# EAGLE design untitled (EAGLE 8.2.0)
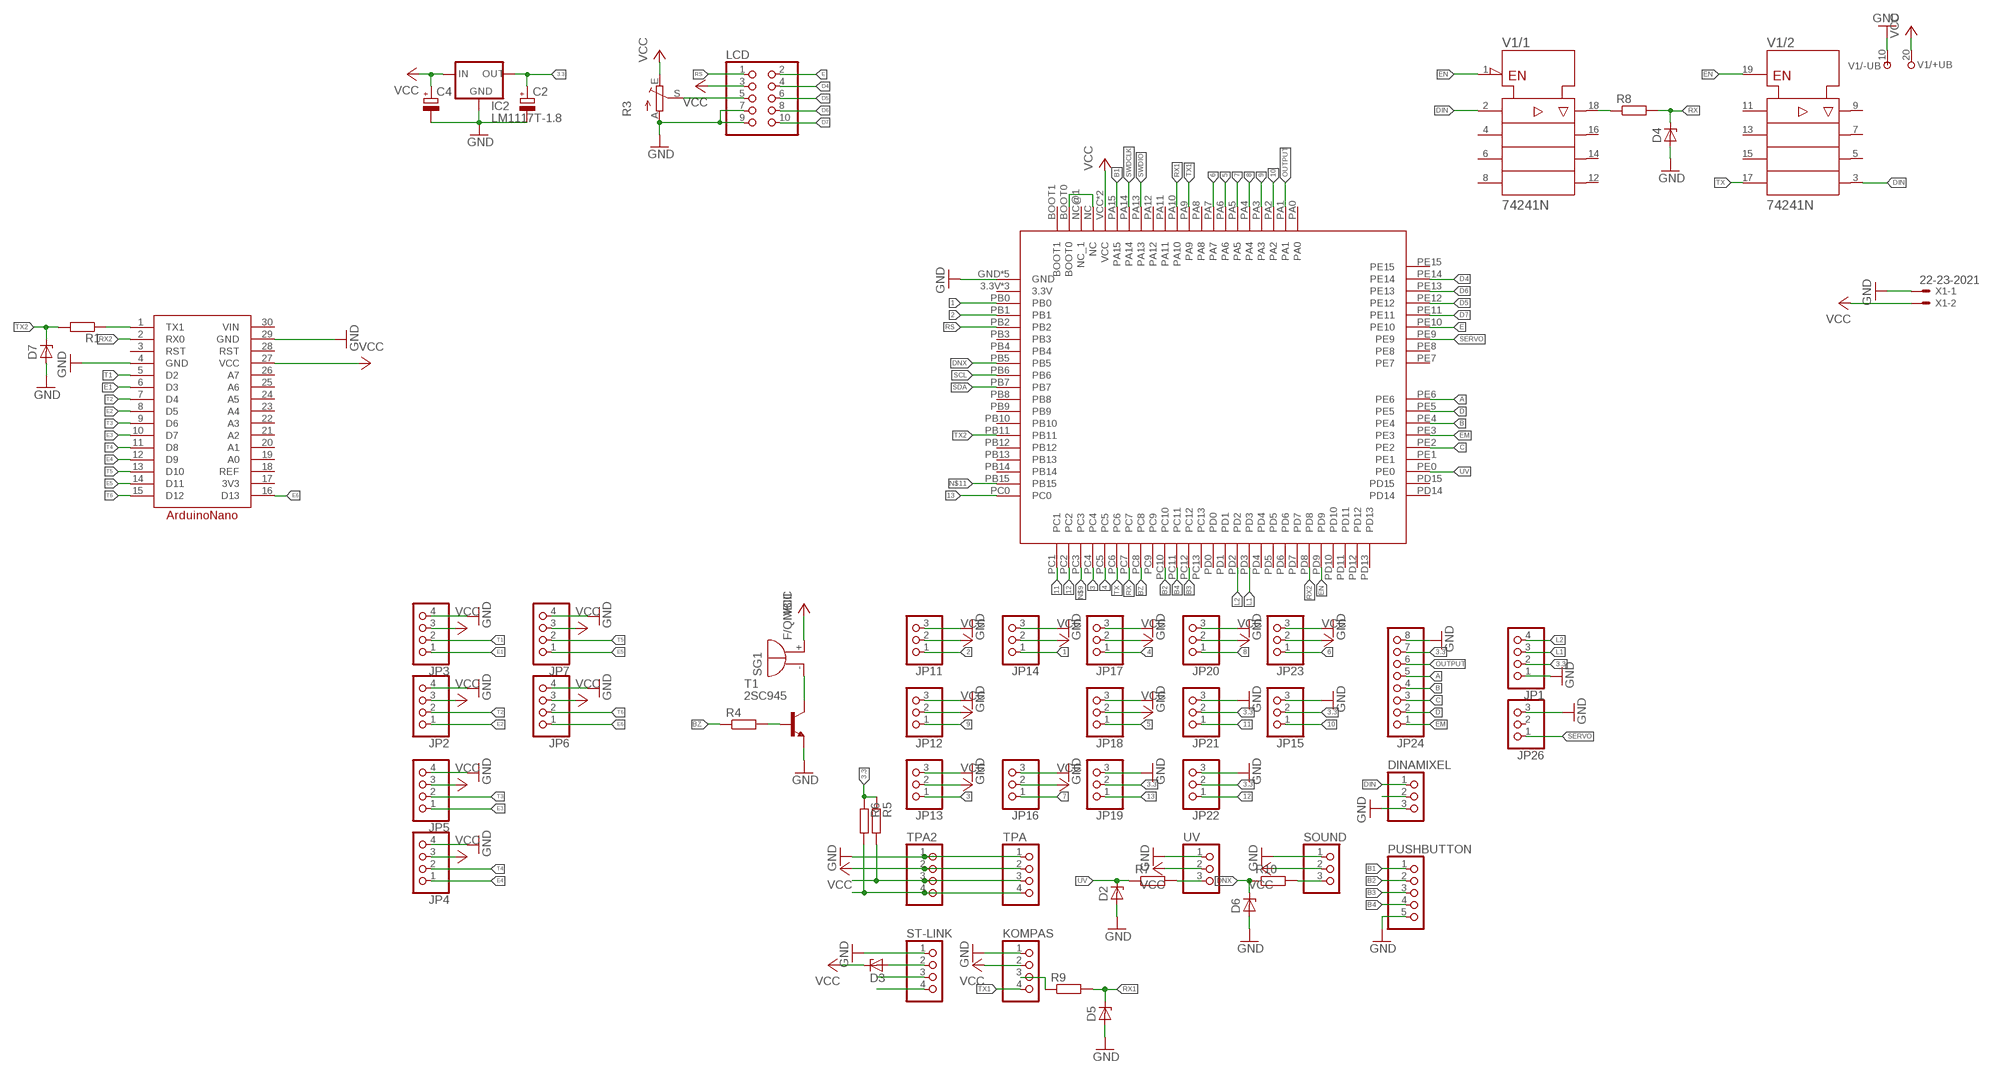
[diagram p0: schematic, sheet 1]

## Parts
A1  ARDUINONANO  [ARDUINONANO]
C2  CPOL-EUE2.5-5  [E2,5-5]
C4  CPOL-EUE2.5-5  [E2,5-5]
D2  ZENER-DIODEDO34-7  [DO34Z7]
D3  ZENER-DIODEDO34-7  [DO34Z7]
D4  ZENER-DIODEDO34-7  [DO34Z7]
D5  ZENER-DIODEDO34-7  [DO34Z7]
D6  ZENER-DIODEDO34-7  [DO34Z7]
D7  ZENER-DIODEDO34-7  [DO34Z7]
DINAMIXEL  PINHD-1X3  [1X03]
IC2  LM1117T-1.8  [TO220]
JP1  PINHD-1X4  [1X04]
JP2  PINHD-1X4  [1X04]
JP3  PINHD-1X4  [1X04]
JP4  PINHD-1X4  [1X04]
JP5  PINHD-1X4  [1X04]
JP6  PINHD-1X4  [1X04]
JP7  PINHD-1X4  [1X04]
JP11  PINHD-1X3  [1X03]
JP12  PINHD-1X3  [1X03]
JP13  PINHD-1X3  [1X03]
JP14  PINHD-1X3  [1X03]
JP15  PINHD-1X3  [1X03]
JP16  PINHD-1X3  [1X03]
JP17  PINHD-1X3  [1X03]
JP18  PINHD-1X3  [1X03]
JP19  PINHD-1X3  [1X03]
JP20  PINHD-1X3  [1X03]
JP21  PINHD-1X3  [1X03]
JP22  PINHD-1X3  [1X03]
JP23  PINHD-1X3  [1X03]
JP24  PINHD-1X8  [1X08]
JP26  PINHD-1X3  [1X03]
KOMPAS  PINHD-1X4  [1X04]
LCD  PINHD-2X5  [2X05]
PUSHBUTTON  PINHD-1X5  [1X05]
R1  R-EU_0204/7  [0204/7]
R3  TRIM_EU-CA6V  [CA6V]
R4  R-EU_0204/7  [0204/7]
R5  R-EU_0204/7  [0204/7]
R6  R-EU_0204/7  [0204/7]
R7  R-EU_0204/7  [0204/7]
R8  R-EU_0204/7  [0204/7]
R9  R-EU_0204/7  [0204/7]
R10  R-EU_0204/7  [0204/7]
SG1  F/QMBIII  [F/QMBIII]
SOUND  PINHD-1X3  [1X03]
ST-LINK  PINHD-1X4  [1X04]
T1  2SC945  [TO92-ECB]
TPA  PINHD-1X4  [1X04]
TPA2  PINHD-1X4  [1X04]
U$1  STM32F4  [STM32F4]
UV  PINHD-1X3  [1X03]
V1  74241N  [DIL20]
X1  22-23-2021  [22-23-2021]

## Nets
1: JP14.1 U$1.PB0
2: JP11.1 U$1.PB1
3: JP13.1 U$1.PC4
3.3: C2.+ IC2.2(OUT) JP1.2 JP15.2 JP19.2 JP21.2 JP22.2 JP24.7 R5.1 R6.1
4: JP17.1 U$1.PC5
5: JP18.1 U$1.PA6
6: JP23.1 U$1.PA7
7: JP16.1 U$1.PA5
8: JP20.1 U$1.PA4
9: JP12.1 U$1.PA3
10: JP15.1 U$1.PA2
11: JP21.1 U$1.PC1
12: JP22.1 U$1.PC2
13: JP19.1 U$1.PC0
A: JP24.5 U$1.PE6
B: JP24.4 U$1.PE4
B1: PUSHBUTTON.1 U$1.PA15
B2: PUSHBUTTON.2 U$1.PC10
B3: PUSHBUTTON.3 U$1.PC12
B4: PUSHBUTTON.4 U$1.PC11
BZ: R4.1 U$1.PC8
C: JP24.3 U$1.PE2
D: JP24.2 U$1.PE5
D4: LCD.4 U$1.PE14
D5: LCD.6 U$1.PE12
D6: LCD.8 U$1.PE13
D7: LCD.10 U$1.PE11
DIN: DINAMIXEL.1 V1.2(/1:A1) V1.3(/2:Y4)
DNX: D6.C R10.1 U$1.PB5
E: LCD.2 U$1.PE10
E1: A1.6(D3) JP3.1
E2: A1.8(D5) JP2.1
E3: A1.10(D7) JP5.1
E4: A1.12(D9) JP4.1
E5: A1.14(D11) JP7.1
E6: A1.16(D13) JP6.1
EM: JP24.1 U$1.PE3
EN: U$1.PD9 V1.1(/1:!G) V1.19(/2:G)
GND: A1.4(GND) A1.29(GND) C2.- C4.- D2.A D4.A D5.A D6.A D7.A DINAMIXEL.3 IC2.1(GND) JP1.1 JP2.4 JP3.4 JP4.4 JP5.4 JP6.4 JP7.4 JP11.3 JP12.3 JP13.3 JP14.3 JP15.3 JP16.3 JP17.3 JP18.3 JP19.3 JP20.3 JP21.3 JP22.3 JP23.3 JP24.8 JP26.3 KOMPAS.1 LCD.7 LCD.9 PUSHBUTTON.5 R3.A SOUND.1 ST-LINK.1 T1.E TPA2.1 TPA.1 U$1.GND U$1.GND@1(GND) U$1.GND@2(GND) U$1.GND@3(GND) U$1.GND@5(GND) UV.1 V1.10(/-UB:-UB) X1.1
L1: JP1.3 U$1.PD3
L2: JP1.4 U$1.PD2
N$1: A1.1(TX1) R1.1
N$2: D3.A ST-LINK.2
N$5: KOMPAS.3 R9.1
N$6: R7.2 UV.3
N$7: LCD.5 R3.S
N$8: DINAMIXEL.2
N$9: U$1.PC3
N$10: R8.1 V1.18(/1:Y1)
N$11: U$1.PB15
N$12: R10.2 SOUND.3
N$15: U$1.BOOT0 U$1.NC
N$16: SG1.-(+) T1.C
N$17: R4.2 T1.B
OUTPUT: JP24.6 U$1.PA1
RS: LCD.1 U$1.PB2
RX: D4.C R8.2 U$1.PC7
RX1: D5.C R9.2 U$1.PA10
RX2: A1.2(RX0) U$1.PD8
SCL: R6.2 TPA2.4 TPA.4 U$1.PB6
SDA: R5.2 TPA2.3 TPA.3 U$1.PB7
SERVO: JP26.1 U$1.PE9
SWDCLK: ST-LINK.3 U$1.PA14
SWDIO: ST-LINK.4 U$1.PA13
T1: A1.5(D2) JP3.2
T2: A1.7(D4) JP2.2
T3: A1.9(D6) JP5.2
T4: A1.11(D8) JP4.2
T5: A1.13(D10) JP7.2
T6: A1.15(D12) JP6.2
TX: U$1.PC6 V1.17(/2:A4)
TX1: KOMPAS.4 U$1.PA9
TX2: D7.C R1.2 U$1.PB11
UV: D2.C R7.1 U$1.PE0
VCC: A1.27(VCC) C4.+ D3.C IC2.3(IN) JP2.3 JP3.3 JP4.3 JP5.3 JP6.3 JP7.3 JP11.2 JP12.2 JP13.2 JP14.2 JP16.2 JP17.2 JP18.2 JP20.2 JP23.2 KOMPAS.2 LCD.3 R3.E SG1.+(-) SOUND.2 TPA2.2 TPA.2 U$1.VCC U$1.VCC@1(VCC) UV.2 V1.20(/+UB:+UB) X1.2
Unconnected: A1.3(RST) A1.19(A0) A1.20(A1) A1.21(A2) A1.22(A3) A1.23(A4) A1.24(A5) A1.25(A6) A1.26(A7) A1.28(RST) JP26.2 U$1.3.3V U$1.3.3V@2(3.3V) U$1.3.3V@3(3.3V) U$1.BOOT1 U$1.NC@1(NC_1) U$1.PA0 U$1.PA8 U$1.PA11 U$1.PA12 U$1.PB3 U$1.PB4 U$1.PB8 U$1.PB9 U$1.PB10 U$1.PB12 U$1.PB13 U$1.PB14 U$1.PC9 U$1.PC13 U$1.PD0 U$1.PD1 U$1.PD4 U$1.PD5 U$1.PD6 U$1.PD7 U$1.PD10 U$1.PD11 U$1.PD12 U$1.PD13 U$1.PD14 U$1.PD15 U$1.PE1 U$1.PE7 U$1.PE8 U$1.PE15 V1.4(/1:A2) V1.5(/2:Y3) V1.6(/1:A3) V1.7(/2:Y2) V1.8(/1:A4) V1.9(/2:Y1) V1.11(/2:A1) V1.12(/1:Y4) V1.13(/2:A2) V1.14(/1:Y3) V1.15(/2:A3) V1.16(/1:Y2)

## Power pins joined to a net without a drawn wire
3V3: A1.17(3V3)
REF: A1.18(REF)
VIN: A1.30(VIN)

## Library data of the parts
A1 = Arduino:ARDUINONANO
C2 C4 = rcl:CPOL-EU: POLARIZED CAPACITOR, European symbol
D2-D7 = diode:ZENER-DIODE: Z-Diode
DINAMIXEL JP11-JP23 JP26 SOUND UV = pinhead:PINHD-1X3: PIN HEADER
IC2 = lm1117:LM1117T-*
JP1-JP7 KOMPAS ST-LINK TPA TPA2 = pinhead:PINHD-1X4: PIN HEADER
JP24 = pinhead:PINHD-1X8: PIN HEADER
LCD = pinhead:PINHD-2X5: PIN HEADER
PUSHBUTTON = pinhead:PINHD-1X5: PIN HEADER
R1 R4-R10 = rcl:R-EU_: RESISTOR, European symbol
R3 = pot:TRIM_EU-: POTENTIOMETER
SG1 = buzzer:F/QMBIII: BUZZER Source: Buerklin; OC_FARNELL: unknown; OC_NEWARK: unknown
T1 = transistor:2SC945: NPN Silicon Epitaxial Planar Transistor Source: SEMTECH ELECTRONICS LTD. ... 2SC945 2.pdf
U$1 = STM32F407-2:STM32F4
V1 = 74ttl-din:74*241: Octal BUFFER and LINE DRIVER, 3-state
X1 = con-molex:22-23-2021: .100" (2.54mm) Center Header - 2 Pin; MF: MOLEX; MPN: 22-23-2021; OC_FARNELL: 1462926; OC_NEWARK: 25C3832

## Board
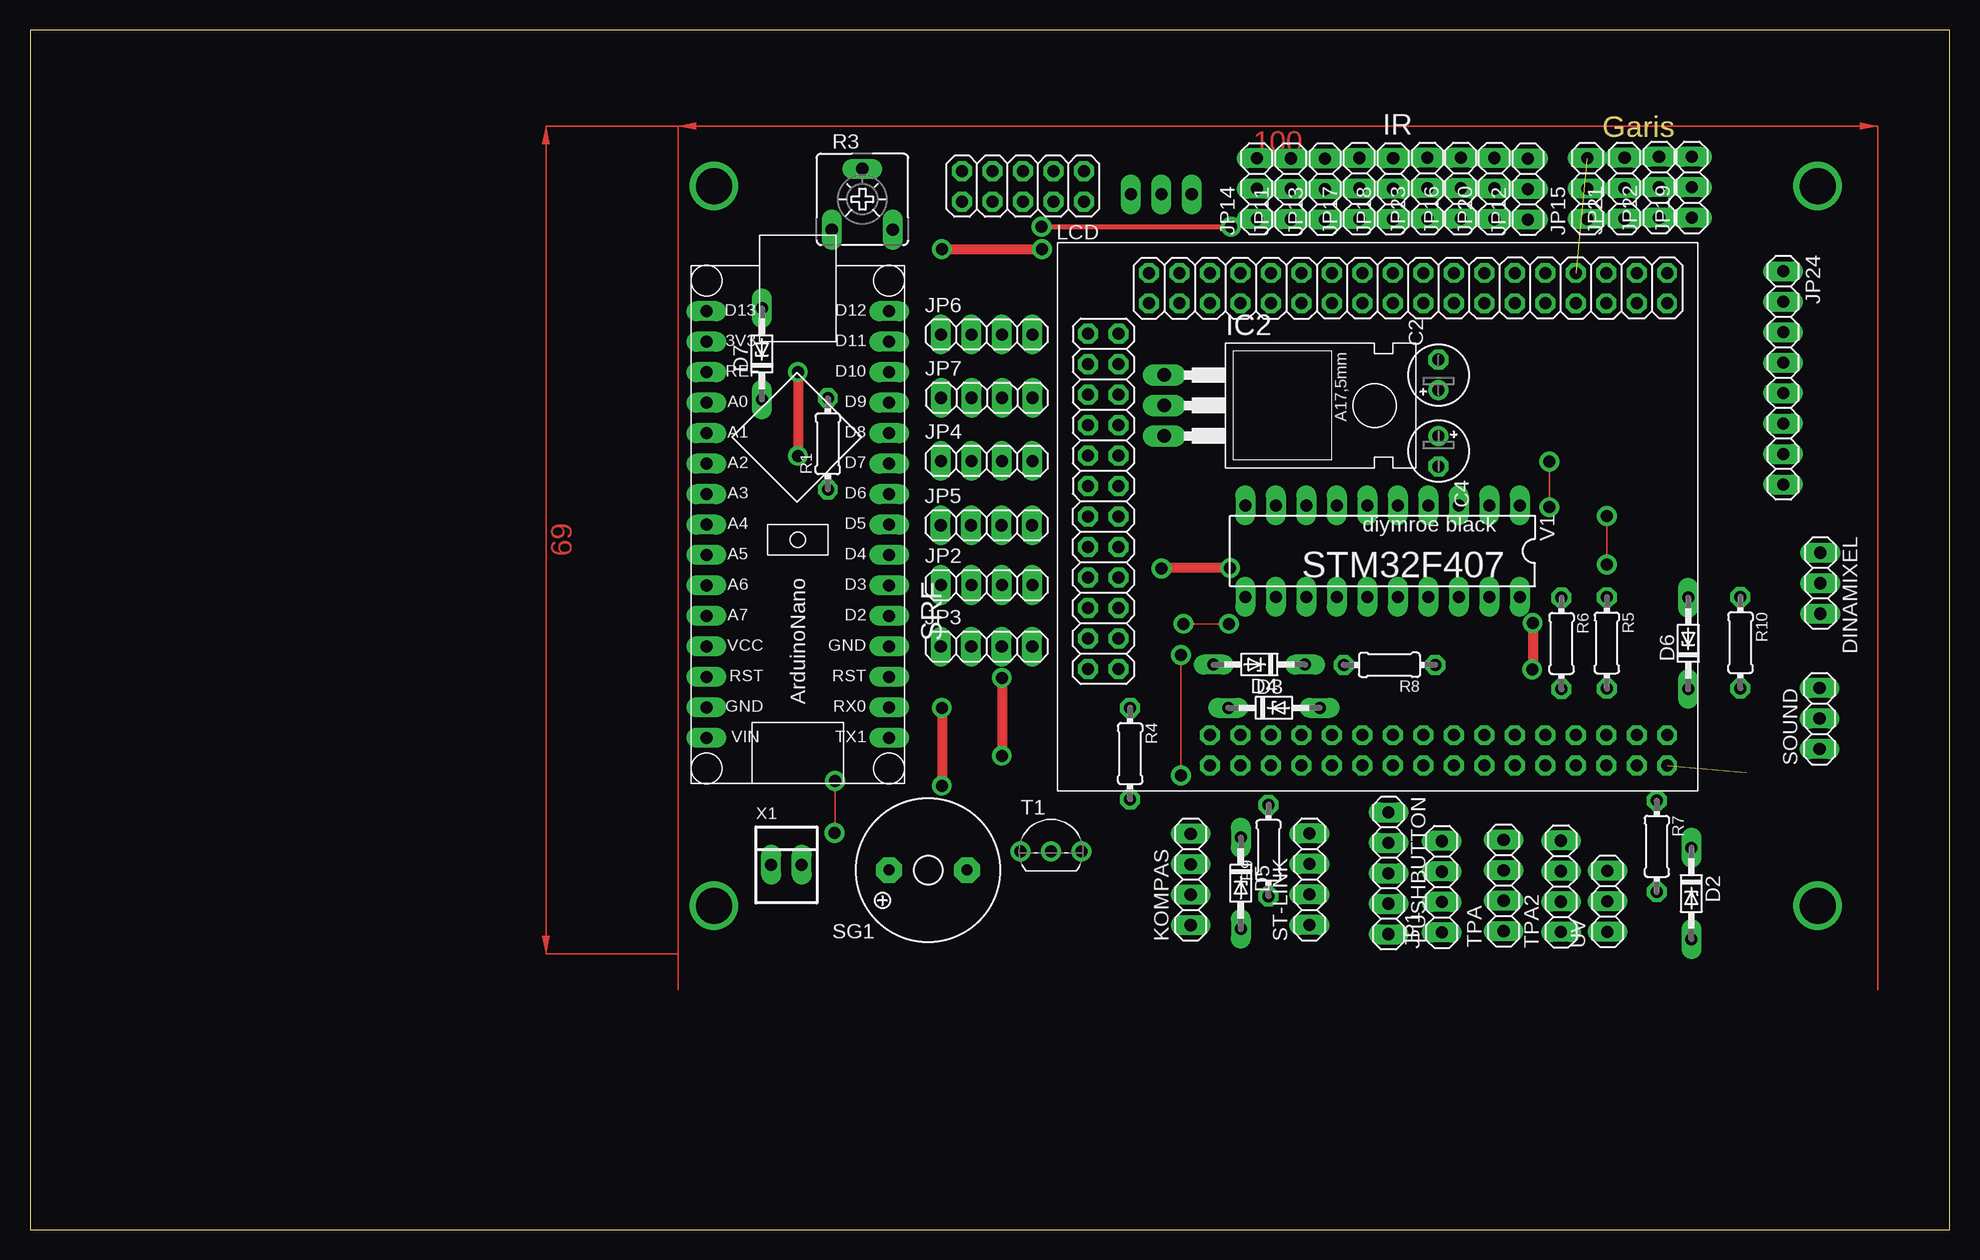
[diagram p1: board, top side]
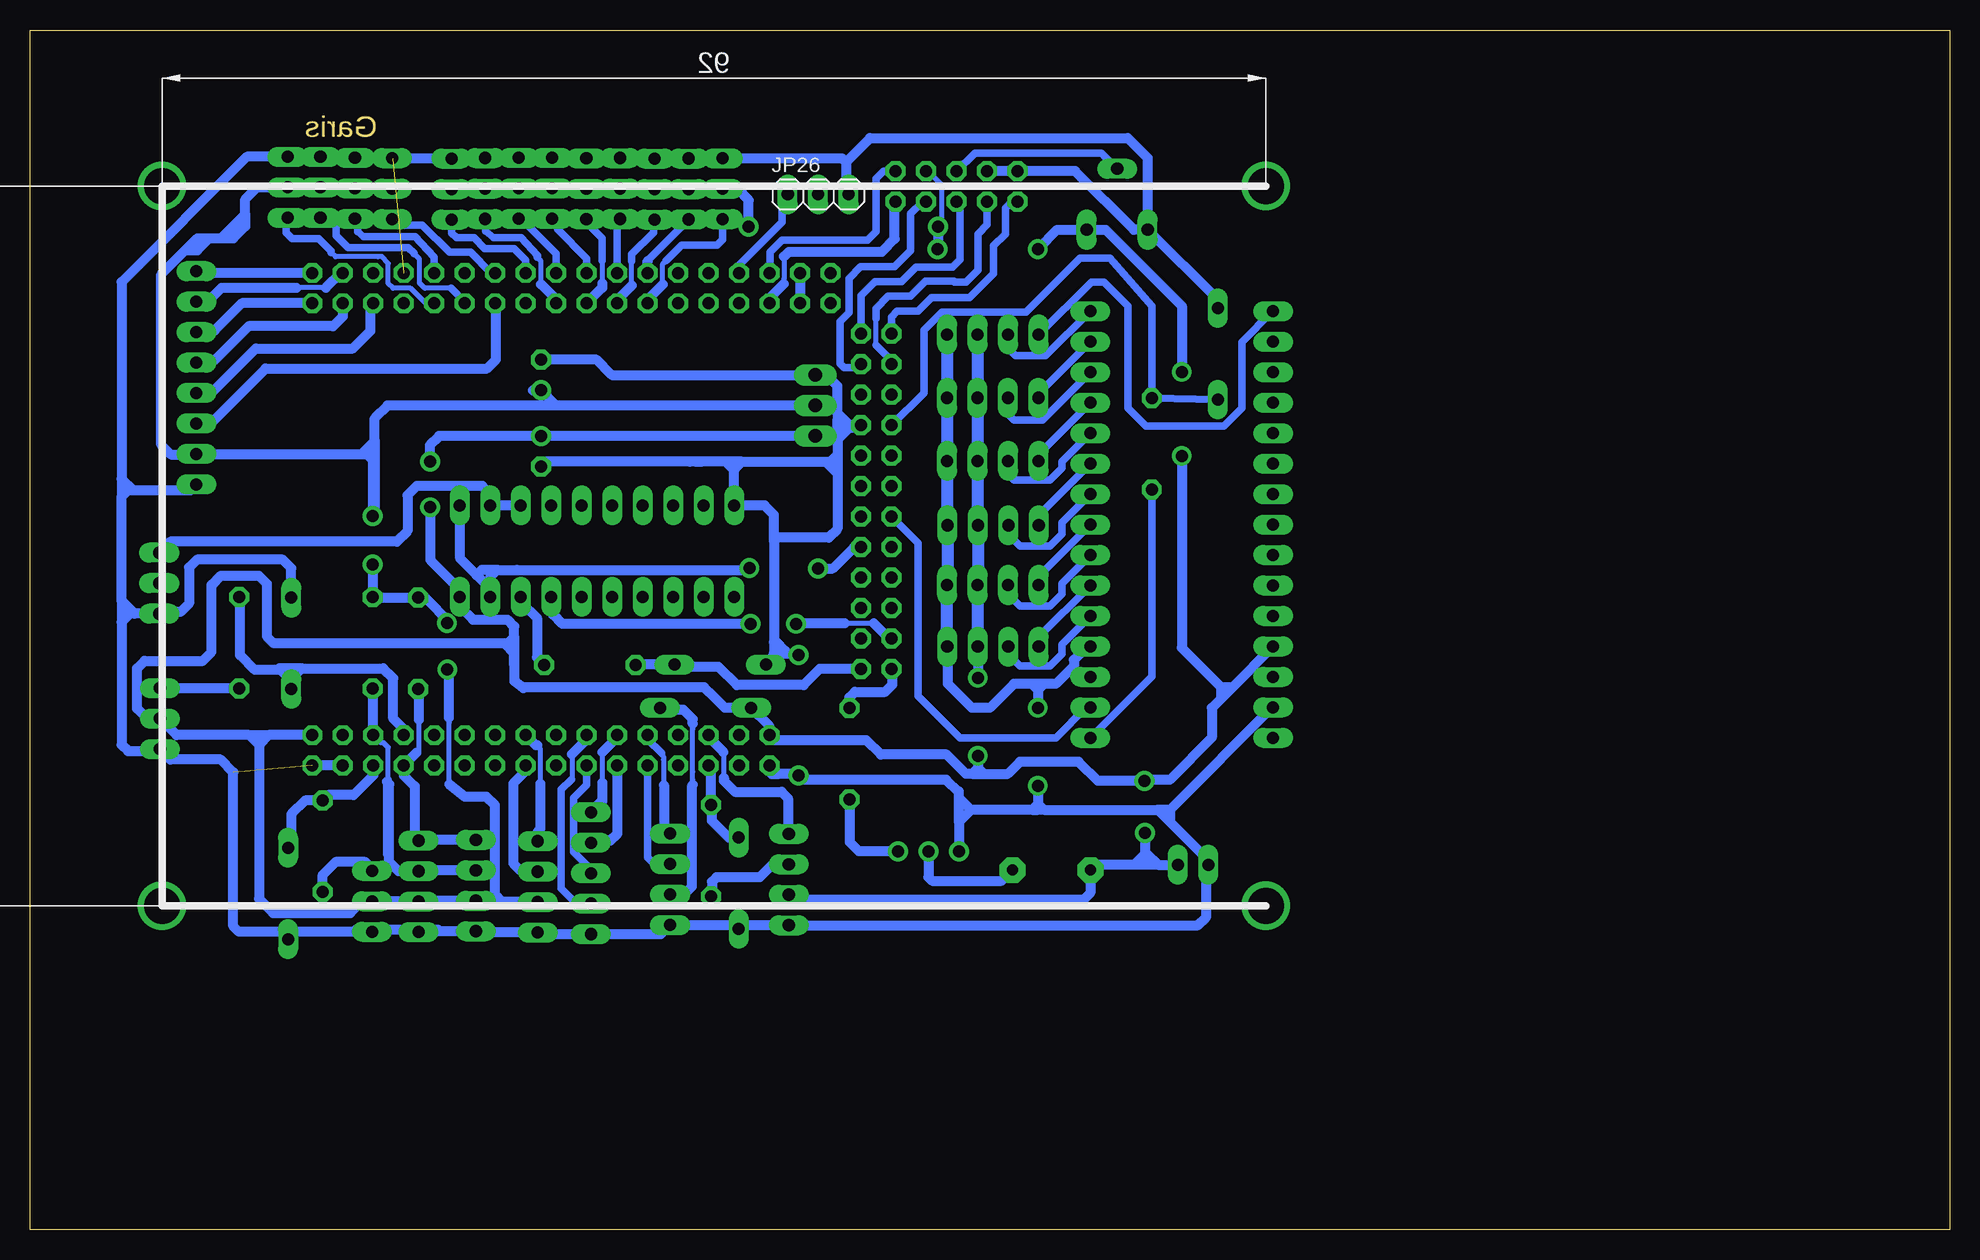
[diagram p2: board, bottom side, seen from below]

Size 160 x 100 mm. Coordinates in mm from the lower left corner, seen from the top.
Outline: 0,0 160,0 160,100 0,100 0,0
Copper layers (1*16): Top 0.035mm / dielectric 1.5mm / Bottom 0.035mm
Design rules "default *": minimum track width 6mil, minimum drill 1mm, track to track 6mil, track to pad 7mil, pad to pad 6mil, via to via 6mil, smd to smd 6mil, copper to edge 40mil, drill to drill 6mil, minimum pad ring 13mil, minimum via ring 13mil, stop-mask expansion 4mil, vias tented up to drill 0mil, thermal gap 10mil

### Footprints (pad centres in the part's own frame; a part is rotated, then mirrored left to right if it is on the bottom)
ARDUINONANO = drill 1 pad 1.575 long: 1 -7.62,16.51; 2 -7.62,13.97; 3 -7.62,11.43; 4 -7.62,8.89; 5 -7.62,6.35; 6 -7.62,3.81; 7 -7.62,1.27; 8 -7.62,-1.27; 9 -7.62,-3.81; 10 -7.62,-6.35; 11 -7.62,-8.89; 12 -7.62,-11.43; 13 -7.62,-13.97; 14 -7.62,-16.51; 15 -7.62,-19.05; 16 7.62,-19.05; 17 7.62,-16.51; 18 7.62,-13.97; 19 7.62,-11.43; 20 7.62,-8.89; 21 7.62,-6.35; 22 7.62,-3.81; 23 7.62,-1.27; 24 7.62,1.27; 25 7.62,3.81; 26 7.62,6.35; 27 7.62,8.89; 28 7.62,11.43; 29 7.62,13.97; 30 7.62,16.51
E2,5-5 = drill 1 pad 1.6: + -1.27,0 | drill 1 pad 1.6 octagon: - 1.27,0
DO34Z7 = drill 1 long: A 3.81,0; C -3.81,0
1X03 = drill 1.016 long: 1 -2.54,0; 2 0,0; 3 2.54,0
TO220 = drill 1.118 long: 1 -2.54,-6.35; 2 0,-6.35; 3 2.54,-6.35
1X04 = drill 1.016 long: 1 -3.81,0; 2 -1.27,0; 3 1.27,0; 4 3.81,0
1X08 = drill 1.016 long: 1 -8.89,0; 2 -6.35,0; 3 -3.81,0; 4 -1.27,0; 5 1.27,0; 6 3.81,0; 7 6.35,0; 8 8.89,0
2X05 = drill 1 octagon: 1 -5.08,-1.27; 2 -5.08,1.27; 3 -2.54,-1.27; 4 -2.54,1.27; 5 0,-1.27; 6 0,1.27; 7 2.54,-1.27; 8 2.54,1.27; 9 5.08,-1.27; 10 5.08,1.27
1X05 = drill 1.016 long: 1 -5.08,0; 2 -2.54,0; 3 0,0; 4 2.54,0; 5 5.08,0
0204/7 = drill 1 octagon: 1 -3.81,0; 2 3.81,0
CA6V = drill 1.016 long: A -2.54,-2.54; E 2.54,-2.54; S 0,2.54
F/QMBIII = drill 0.914 pad 2.159 octagon: + 3.251,0; - -3.251,0
TO92-ECB = drill 1: B 2.54,0; C 0,0; E -2.54,0
STM32F4 = drill 1 octagon: 3.3V 13.97,-16.95; 3.3V@2 -29.21,6.35; 3.3V@3 8.89,19.05; BOOT0 -24.13,21.59; BOOT1 -26.67,21.59; GND 16.51,-19.49; GND@1 13.97,-19.49; GND@2 -21.59,-19.49; GND@3 -29.21,8.89; GND@5 8.89,21.59; NC -24.13,19.05; NC@1 -26.67,19.05; PA0 3.81,21.59; PA1 1.27,19.05; PA2 1.27,21.59; PA3 -1.27,21.59; PA4 -3.81,19.05; PA5 -3.81,21.59; PA6 -6.35,19.05; PA7 -6.35,21.59; PA8 -19.05,-19.49; PA9 -16.51,-16.95; PA10 -16.51,-19.49; PA11 -13.97,-16.95; PA12 -13.97,-19.49; PA13 -11.43,-16.95; PA14 -11.43,-19.49; PA15 -8.89,-16.95; PB0 -11.43,19.05; PB1 -11.43,21.59; PB2 -21.59,21.59; PB3 6.35,-16.95; PB4 6.35,-19.49; PB5 8.89,-16.95; PB6 8.89,-19.49; PB7 11.43,-16.95; PB8 -13.97,19.05; PB9 -13.97,21.59; PB10 -29.21,11.43; PB11 -31.75,8.89; PB12 -31.75,6.35; PB13 -29.21,3.81; PB14 -31.75,3.81; PB15 -29.21,1.27; PC0 6.35,19.05; PC1 6.35,21.59; PC2 3.81,19.05; PC3 -1.27,19.05; PC4 -8.89,19.05; PC5 -8.89,21.59; PC6 -31.75,-8.89; PC7 -29.21,-11.43; PC8 -31.75,-11.43; PC9 -19.05,-16.95; PC10 -8.89,-19.49; PC11 -6.35,-16.95; PC12 -6.35,-19.49; PC13 11.43,21.59; PD0 -3.81,-16.95; PD1 -3.81,-19.49; PD2 -1.27,-16.95; PD3 -1.27,-19.49; PD4 1.27,-16.95; PD5 1.27,-19.49; PD6 3.81,-16.95; PD7 3.81,-19.49; PD8 -31.75,1.27; PD9 -29.21,-1.27; PD10 -31.75,-1.27; PD11 -29.21,-3.81; PD12 -31.75,-3.81; PD13 -29.21,-6.35; PD14 -31.75,-6.35; PD15 -29.21,-8.89; PE0 11.43,-19.49; PE1 -16.51,19.05; PE2 16.51,19.05; PE3 16.51,21.59; PE4 13.97,19.05; PE5 13.97,21.59; PE6 11.43,19.05; PE7 -16.51,21.59; PE8 -19.05,19.05; PE9 -19.05,21.59; PE10 -21.59,19.05; PE11 -31.75,16.51; PE12 -29.21,16.51; PE13 -31.75,13.97; PE14 -29.21,13.97; PE15 -31.75,11.43; VCC 16.51,-16.95; VCC@1 -21.59,-16.95
DIL20 = drill 1 long: 1 -11.43,-3.81; 2 -8.89,-3.81; 3 -6.35,-3.81; 4 -3.81,-3.81; 5 -1.27,-3.81; 6 1.27,-3.81; 7 3.81,-3.81; 8 6.35,-3.81; 9 8.89,-3.81; 10 11.43,-3.81; 11 11.43,3.81; 12 8.89,3.81; 13 6.35,3.81; 14 3.81,3.81; 15 1.27,3.81; 16 -1.27,3.81; 17 -3.81,3.81; 18 -6.35,3.81; 19 -8.89,3.81; 20 -11.43,3.81
22-23-2021 = drill 1 long: 1 -1.27,0; 2 1.27,0

### Placement (x,y rotation side)
A1  64,57.5 180 top
C2  117.41,71.24 90 top
C4  117.41,64.89 270 top
D2  138.48,28.01 270 top
D3  103.69,43.49 0 top
D4  102.47,47.1 180 top
D5  100.92,28.87 270 top
D6  138.22,48.87 90 top
D7  61,73 90 top
DINAMIXEL  149.23,53.88 270 top
IC2  100.9,68.7 270 top
JP1  117.68,28.57 90 top
JP2  79.74,53.73 0 top
JP3  79.73,48.6 0 top
JP4  79.74,64.07 0 top
JP5  79.72,58.7 0 top
JP6  79.74,74.61 0 top
JP7  79.75,69.34 0 top
JP11  105.1,86.75 90 top
JP12  124.86,86.74 90 top
JP13  107.94,86.74 90 top
JP14  102.26,86.77 90 top
JP15  129.82,86.78 90 top
JP16  119.26,86.81 90 top
JP17  110.81,86.79 90 top
JP18  113.63,86.77 90 top
JP19  138.53,86.89 90 top
JP20  122.06,86.79 90 top
JP21  132.91,86.81 90 top
JP22  135.79,86.89 90 top
JP23  116.48,86.81 90 top
JP24  146.14,71 270 top
JP26  94.3,86.3 0 bottom
KOMPAS  96.75,29.18 90 top
LCD  82.76,86.97 180 top
PUSHBUTTON  113.24,29.7 270 top
R1  66.5,65.5 90 top
R3  69.38,85.89 0 top
R4  91.7,39.67 270 top
R5  131.44,48.9 270 top
R6  127.66,48.86 270 top
R7  135.6,31.95 270 top
R8  113.32,47.07 180 top
R9  103.23,31.59 90 top
R10  142.57,48.92 270 top
SG1  74.86,29.96 180 top
SOUND  149.17,42.6 90 top
ST-LINK  106.65,29.2 90 top
T1  85.11,31.53 0 top
TPA  122.84,28.68 90 top
TPA2  127.61,28.61 90 top
U$1  119.95,58.16 0 top
UV  131.49,27.36 90 top
V1  112.74,56.56 180 top
X1  63.05,30.4 0 top

### Tracks (layer width: path | path; a pad name or v marks a point on that pad's centre or on a via)
1
  Bottom 0.406: 107.27,78.79 107.27,80.49 106.98,80.78
  Bottom 0.61: 106.98,80.78 106.96,80.78 105.67,82.07 102.72,82.07 102.26,82.53 JP14.1
  Bottom 0.813: U$1.PB0 108.52,77.54 107.27,78.79
2
  Bottom 0.61: 108.52,80.77 105.57,83.72 105.57,83.74 JP11.1
  Bottom 0.813: U$1.PB1 108.52,80.77
3
  Bottom 0.406: 109.84,78.69 109.84,80.75
  Bottom 0.61: 109.84,80.75 109.84,81.3 108.04,83.1 108.04,84.1 JP13.1
  Bottom 0.813: U$1.PC4 111.06,77.47 109.84,78.69
3.3  (via drill 1)
  Top 0.127: v131.45,59.49 v131.45,55.45
  Top 0.813: v125.25,50.57 125.25,46.72 v125.21,46.68
  Bottom 0.406: 125.05,37.12 125.05,42.3 125.08,42.68
  Bottom 0.813: JP15.2 132.88,86.78 JP21.2 135.71,86.81 JP22.2 JP19.2 141.05,86.89 142.05,85.89 142.05,84.63 | IC2.2 116.14,68.7 | 116.14,68.7 C2.+ 118.1,69.97 | 132.35,64.65 JP24.7 146.17,64.62 148.27,64.62 149.05,65.4 149.05,79.63 146.05,82.63 145.05,82.63 | 132.35,64.65 131.92,64.65 131.39,64.12 131.39,59.43 | 131.39,59.31 131.39,59.43 | 131.39,59.43 v131.45,59.49 | v131.45,55.45 R5.1 131.4,52.67 R6.1 127.07,52.67 125.01,50.61 125.21,50.61 v125.25,50.57 | 116.14,68.7 130.2,68.7 131.27,67.63 131.27,65.73 | 131.27,65.73 131.27,59.55 131.39,59.43 | 132.35,64.65 131.27,65.73 | 144.05,82.63 143.05,82.63 142.05,83.63 142.05,84.63 | 145.05,82.63 144.05,82.63 | 144.05,82.63 142.05,84.63 | 147.05,81.63 146.05,81.63 145.05,82.63 | JP1.2 120.67,27.3 121.25,27.88 121.25,35.39 121.94,36.08 123.76,36.08 125.05,37.12 | 125.08,42.68 125.08,46.55 v125.21,46.68
4
  Bottom 0.61: U$1.PC5 111.06,84 JP17.1
5
  Bottom 0.406: 112.3,80.76 112.3,78.87
  Bottom 0.61: JP18.1 113.63,83.97 112.32,82.66 112.32,80.78 112.3,80.76
  Bottom 0.813: 112.3,78.87 112.3,78.51 U$1.PA6
6
  Bottom 0.61: U$1.PA7 113.6,80.95 116.03,83.38 116.03,83.82 JP23.1
7
  Bottom 0.61: U$1.PA5 116.14,81.35 118.8,84.01 119,84.01 JP16.1
8
  Bottom 0.406: 117.4,78.81 117.4,80.74 117.71,81.05
  Bottom 0.61: 117.71,81.05 117.68,81.17 119.07,82.7 121.36,82.7 122.04,83.24 122.04,84.23 JP20.1
  Bottom 0.813: U$1.PA4 116.14,77.55 117.4,78.81
9
  Bottom 0.61: U$1.PA3 118.68,80.8 119.66,81.78 122.09,81.78 122.98,82.67 124.45,82.67 124.85,83.07 JP12.1
10
  Bottom 0.61: U$1.PA2 121.57,79.75 123.29,81.47 125.04,81.47 127.31,83.74 129.32,83.74 JP15.1
11
  Bottom 0.61: U$1.PC1 126.3,81.08 127.9,82.76 132.17,82.76 132.67,83.18 132.67,84.03 JP21.1
12
  Bottom 0.406: 124.91,78.46 127.09,78.46 127.53,78.9 127.53,80.91 127.98,81.36
  Bottom 0.61: 123.76,77.31 124.91,78.46 | 127.98,81.36 127.98,81.39 128.46,81.85 133.46,81.85 134.46,82.87 134.46,83.99 134.85,84.38 135.76,84.38 JP22.1
  Bottom 0.813: U$1.PC2 123.76,77.31
13
  Bottom 0.406: U$1.PC0 127.04,77.21 128.29,78.46 129.74,78.46 130.13,78.85 130.13,80.55 130.65,81.12 130.99,81.12 130.99,81.1 134.53,81.1 134.88,81.42
  Bottom 0.61: 134.88,81.42 134.88,81.56 135.94,82.62 138.15,82.62 138.65,83.12 138.65,84.23 JP19.1
A
  Bottom 0.813: JP24.5 144.88,69.73 141.17,73.44 133.1,73.44 131.62,74.92 131.62,76.97 U$1.PE6
B
  Bottom 0.813: U$1.PE4 133.92,76.12 134.74,75.3 141.78,75.3 144.59,72.49 145.92,72.49 JP24.4
B1
  Bottom 0.406: 112.31,39.78 112.31,37.27
  Bottom 0.813: U$1.PA15 111.06,41.03 112.31,39.78 | 112.31,37.27 112.31,35.71 PUSHBUTTON.1
B2
  Bottom 0.813: U$1.PC10 111.06,32.99 111.63,32.42 113.06,32.42 PUSHBUTTON.2
B3
  Bottom 0.61: U$1.PC12 113.6,37.07 114.67,36 114.67,31.46 113.4,30.19 113.4,29.86
  Bottom 0.813: 113.4,29.86 PUSHBUTTON.3
B4
  Bottom 0.406: 114.83,39.64 114.83,37.56 114.85,37.54
  Bottom 0.61: 114.85,37.54 114.86,37.54 115.73,36.67 115.73,28.45 114.72,27.44 113.52,27.44 PUSHBUTTON.4
  Bottom 0.813: U$1.PC11 113.6,40.87 114.83,39.64
BZ
  Bottom 0.813: R4.1 91.7,44.36 91.24,44.82 88.72,44.82 88.12,45.42 88.12,46.65 U$1.PC8
C
  Bottom 0.813: U$1.PE2 142.34,77.21 144.59,74.96 145.99,74.96 JP24.3
D
  Bottom 0.406: 135.35,78.52 137.77,78.52 137.79,78.5
  Bottom 0.813: U$1.PE5 134.12,79.75 135.35,78.52 | 137.79,78.5 144.05,78.5 145.06,77.49 146,77.49 JP24.2
D4
  Bottom 0.61: LCD.4 85.57,85.7 86.59,84.68 86.59,81.59 87.92,80.26 90.76,80.26 91.74,79.28 91.74,76.42 92.46,75.7 92.46,72.19 92.13,71.86 91.01,71.86 U$1.PE14
D5
  Bottom 0.61: 90.74,74.7 U$1.PE12 90.74,77.85 89.57,79.02 87.36,79.02 86.16,80.22 83.12,80.22 82.48,80.86 82.48,85.42 LCD.6
D6
  Bottom 0.406: 89.5,73.72 89.5,75.92
  Bottom 0.61: U$1.PE13 88.2,72.42 89.5,73.72 | 89.5,75.92 89.5,76.77 88.47,77.8 86.61,77.8 85.36,79.05 83,79.05 82.95,79 82,79 81,80 81,83 80.22,83.78 LCD.8
D7
  Bottom 0.61: U$1.PE11 88.2,76.07 87.71,76.56 86,76.56 84.88,77.69 81.69,77.69 79.69,79.69 79.69,82 78.69,83 78.69,85.13 78.31,85.51 77.87,85.51 LCD.10
DIN
  Bottom 0.813: V1.3 V1.2 121.63,61.31 122.3,61.98 127.77,61.98 128.54,61.21 128.54,58.24 129.43,57.35 148.3,57.35 DINAMIXEL.1
DNX
  Bottom 0.813: 139.09,46.66 139.22,46.79 137.35,46.79 | 139.09,46.66 138.22,45.79 D6.C 138.22,45.92 137.35,46.79 | U$1.PB5 128.84,41.72 129.72,42.6 129.72,45.96 130.55,46.79 137.35,46.79 | 139.09,46.66 141.25,46.66 142.49,47.89 142.49,52.65 R10.1
E
  Bottom 0.406: 97.16,78.85 97.16,79.24 97.15,79.25 97.15,81.12
  Bottom 0.813: U$1.PE10 98.36,77.65 97.16,78.85 | LCD.2 87.92,85.62 87.92,82.6 89.02,81.5 96.77,81.5 97.15,81.12
E1
  Bottom 0.61: A1.6 75.92,49.39 JP3.1
E2
  Bottom 0.61: A1.8 75.93,54.46 JP2.1
E3
  Bottom 0.61: A1.10 75.91,59.56 JP5.1
E4
  Bottom 0.61: A1.12 75.93,64.62 JP4.1
E5
  Bottom 0.61: A1.14 75.94,69.69 JP7.1
E6
  Bottom 0.61: JP6.1 71.54,79 70.5,79 68.5,77 68.5,68.5 67,67 60.5,67 59,68.5 59,74 56.45,76.55 A1.16
EM
  Bottom 0.813: U$1.PE3 146,79.75 JP24.1
EN  (via drill 1)
  Top 0.813: v100.04,55.14 94.34,55.14 v94.31,55.11
  Bottom 0.813: 122.78,54.56 121.63,53.41 V1.19 121.63,54.41 121.05,54.99 | 122.78,54.56 124.14,55.92 124.14,60.34 V1.1 | 121.05,54.99 119.43,54.99 99.66,54.99 99.66,55.08 v100.04,55.14 | v94.31,55.11 93.07,55.11 91.28,56.9 U$1.PD9 | 121.05,54.99 122.35,54.99 122.78,54.56
GND  (via drill 1)  (2 unrouted)
  Top 0.127: v95.95,37.85 v95.95,47.91
  Top 0.813: v76,43.5 v76,37
  Bottom 0.61: D4.A 98.66,47.36 97.98,48.04 | v95.95,47.91 97.85,47.91
  Bottom 0.813: C2.- 112.79,72.51 111.52,71.24 IC2.1 93.6,71.24 92.69,70.33 92.69,68.05 | 92.69,68.05 92.69,67.45 | 92.69,67.45 92.09,66.85 90.94,66.85 U$1.GND@3 | 92.69,65.85 92.69,67.45 | 92.69,65.85 92.69,64.62 | 92.69,64.62 93.29,64.02 93.68,64.02 | 100.64,64.02 101.06,64.02 | 100.64,64.02 93.68,64.02 | 101.06,64.02 102.02,64.02 | C4.- 117.01,64.02 104.5,64.02 | U$1.GND@3 91.49,67.05 92.69,65.85 | U$1.GND@3 91.69,67.05 92.69,68.05 | 97.66,37.97 U$1.GND@2 98.51,38.52 | 104.5,64.02 105.02,64.02 | 104.5,64.02 104.06,64.02 | 96.23,37.97 97.66,37.97 | 92.69,64.62 92.69,63.03 | 93.68,64.02 92.69,63.03 | 98.15,37.97 97.66,37.97 | 96.29,37.91 96.23,37.97 | 100.97,25.39 ST-LINK.1 107.42,24.62 PUSHBUTTON.5 117.54,24.62 JP1.1 122.73,24.76 TPA.1 126.13,24.87 126.2,24.8 | 100.97,25.39 D5.A | 100.97,25.39 96.9,25.39 KOMPAS.1 62.63,25.37 62,26 62,30.18 X1.1 61.78,30.78 65,34 | 133,24.82 UV.1 | 133,24.82 137.86,24.82 | 137.86,24.82 D2.A | 137.86,24.82 142.59,24.82 143.06,25.29 143.06,38.12 144.12,39.18 148.29,39.18 148.99,39.88 | 148.99,39.88 SOUND.1 | D6.A 138.22,55.14 138.92,55.84 146.08,55.84 146.73,55.19 146.73,52.2 147.45,51.48 149.09,51.48 DINAMIXEL.3 151.28,51.34 | 151.28,51.34 151.65,51.34 152.36,50.63 | 152.36,50.63 152.36,40.41 151.83,39.88 148.99,39.88 | V1.10 101.39,60.45 | 152.36,52.42 152.36,50.63 | 152.36,52.42 152.36,61.1 | 152.36,61.1 151.83,61.63 151.41,61.63 | 151.41,61.63 146.62,61.63 JP24.8 | 151.28,51.34 152.36,52.42 | 82.57,34 82.57,36 | 82.57,34 T1.E | 82.57,36 82.57,36.43 | 82.57,36.43 83.63,37.49 95.59,37.49 v95.95,37.85 96.07,37.97 96.23,37.97 | 82.57,36.43 82.57,36.53 | 98.28,46.72 D4.A 97.85,47.91 | 97.85,47.91 97.98,48.04 97.98,57.43
  Bottom 0.813: 97.98,48.97 97.77,48.97 97.05,48.25 97.51,48.25 97.85,47.91 | U$1.GND@1 U$1.GND | 152.36,62.58 152.36,61.1 | 152.36,62.58 152.36,79 141.93,89.43 JP19.3 JP22.3 135.71,89.35 JP21.3 132.88,89.32 JP15.3 129.78,89.28 JP12.3 124.81,89.33 JP20.3 122.04,89.35 JP16.3 JP23.3 116.44,89.31 JP18.3 113.61,89.33 JP17.3 110.76,89.28 JP13.3 JP11.3 105.08,89.31 JP14.3 92.31,89.31 92,89 | 151.41,61.63 152.36,62.58 | V1.10 101.31,63.31 | 101.31,63.35 101.31,63.77 101.06,64.02 | 101.31,63.31 102.02,64.02 | 101.31,63.31 101.31,63.35 | 101.31,63.35 100.64,64.02 | 98.77,60.37 97.98,59.58 97.98,57.43 | 98.77,60.37 98.77,60.34 | 92.69,63.03 92.69,58.4 93.42,57.67 97.74,57.67 97.98,57.43 | 98.77,60.37 V1.10 | 126.2,24.8 TPA2.1 | 126.2,24.8 126,25 132.82,25 133,24.82 | 92,89 92,86.54 JP26.3 | LCD.7 LCD.9 72.89,88.24 68,83.35 R3.A | 65,34 65.5,34.5 | 66,35 65.5,34.5 | 75.5,35 76,35 | 75.5,35 66,35 | 76.5,35 76,35 | 76.5,35 81.57,35 | 81.57,35 82.57,36 | 81.57,35 82.57,34 | A1.4 71.89,48.61 73,47.5 73,47 74.5,45.5 75.5,45.5 | 83.55,48.61 83.22,48.28 83.5,48 83.5,45.5 81.5,43.5 80,43.5 78,45.5 76.5,45.5 | D7.A 61,77.51 R3.A | 75.5,45.5 76.5,45.5 | 76,45 75.5,45.5 | 76,45 v76,43.5 | v76,37 76,35.5 | 76,35.5 76,35 | 76,35.5 75.5,35 | 76,35.5 76.5,35 | 76.5,45.5 76,45 | 92,89 90,91 68.5,91 66.84,89.34 R3.A | A1.29 56.47,43.53 65,35 | 65,35 65.5,34.5 | 65,35 66,35 | 65,35 65,34 | 102.02,64.02 104.5,64.02
  Bottom 1.016: JP6.4 83.55,69.35 JP7.4 83.56,64.08 JP4.4 83.55,58.73 JP5.4 83.53,53.75 JP2.4 83.55,48.61 JP3.4
L1
  Bottom 0.813: U$1.PD3 118.68,38.21 119.72,37.17 119.72,30.53 119.21,30.02 117.86,30.02 JP1.3
L2
  Bottom 0.406: 117.45,37.15 117.45,40.1 117.71,40.36
  Bottom 0.813: JP1.4 117.68,33.17 117.45,33.4 117.45,37.15 | 117.71,40.36 117.83,40.36 U$1.PD2
N$1
  Bottom 0.61: R1.1 66.5,46.11 A1.1
N$2
  Bottom 0.406: 104.77,37.08 104.77,37.52 104.77,38.17 104.77,41.71 104.77,42.15
  Bottom 0.813: ST-LINK.2 105.49,27.93 104.82,28.6 104.82,36.88 104.77,37.08 | 104.77,42.15 104.77,42.55 105.54,43.32 107.33,43.32 D3.A
N$5
  Bottom 0.813: KOMPAS.3 98.1,30.45 99.18,29.37 102.78,29.37 103.16,28.99 103.16,27.85 R9.1
N$6
  Bottom 0.813: R7.2 135.6,29.57 135.29,29.88 135.02,30.15 134.54,30.63 132.05,30.63 131.49,30.07 UV.3
N$7
  Bottom 0.61: LCD.5 81.25,89.75 70.7,89.75 R3.S
N$10
  Bottom 0.813: V1.18 119.09,52.32 117.75,50.98 117.75,47.69 R8.1
N$12
  Bottom 0.813: R10.2 149.14,45.11 SOUND.3
N$13  (via drill 3)
  other vias: 57,87
N$14  (via drill 3)
  other vias: 149,87
N$15
  Bottom 0.813: U$1.BOOT0 U$1.NC
N$16
  Bottom 0.813: T1.C 85.11,29.37 84.81,29.07 79,29.07 SG1.-
N$17
  Bottom 0.813: T1.B 90.9,31.53 91.65,32.28 91.65,35.81 R4.2
N$18  (via drill 3)
  other vias: 57,27
N$19  (via drill 3)
  other vias: 149,27
OUTPUT
  Bottom 0.813: JP24.6 144.95,67.19 140.36,71.78 121.91,71.78 121.16,72.53 121.16,77.15 U$1.PA1
RS
  Bottom 0.61: LCD.1 88.86,88.24 89.5,87.6 89.5,83.2 90.2,82.5 97.3,82.5 98.3,81.5 98.3,79.81 U$1.PB2
RX
  Bottom 0.813: U$1.PC7 94.17,46.73 95.52,45.38 101.08,45.38 102.61,46.91 106.09,46.91 D4.C 109.48,47.1 R8.2
RX1
  Bottom 0.813: D5.C 101.76,32.68 103.16,34.08 103.16,35.33 R9.2 103.23,38.46 U$1.PA10
RX2
  Bottom 0.61: U$1.PD8 86,57.23 86,44.5 82.5,41 74.5,41 71.97,43.53 A1.2
SCL
  Bottom 0.406: 127.78,39.77 127.6,39.94 127.6,42.52
  Bottom 0.813: R6.2 127.6,44.39 127.6,42.52 | 127.78,39.77 128.84,38.7 U$1.PB6 128.84,37.85 127.93,36.94 127.93,32.74 TPA2.4 127.54,32.49 TPA.4
SDA
  Bottom 0.406: 130.14,37.46 130.14,40.2 130.52,40.58 130.75,40.58 U$1.PB7
  Bottom 0.61: 130.26,31.26 130.26,37.34 130.14,37.46
  Bottom 0.813: U$1.PB7 131.38,45.03 R5.2 | 130.26,37.34 130.05,37.13 130.05,30.63 129.3,29.88 TPA2.3 127.54,29.95 TPA.3
SERVO
  Bottom 0.61: U$1.PE9 100.9,80.4 97.3,84 97.3,85.84 JP26.1
SWDCLK
  Bottom 0.61: U$1.PA14 108.52,31.03 107.86,30.37 106.75,30.37 ST-LINK.3
SWDIO
  Bottom 0.406: 107.37,39.72 107.37,39.61 107.19,39.43 107.19,39.17 107.19,37.08 107.16,37.05
  Bottom 0.61: U$1.PA13 108.52,40.87 107.37,39.72
  Bottom 0.813: 107.16,37.05 107.16,33.52 ST-LINK.4
T1
  Bottom 0.61: A1.5 74,48.77 74,48 75,47 77.5,47 78.46,47.96 JP3.2
T2
  Bottom 0.61: A1.7 74,53.85 74,53 75,52 77.5,52 78.47,52.97 JP2.2
T3
  Bottom 0.61: A1.9 74,58.93 74,58 75,57 77.5,57 78.45,57.95 JP5.2
T4
  Bottom 0.61: A1.11 74,64.01 74,63.5 75,62.5 78,62.5 78.47,62.97 JP4.2
T5
  Bottom 0.61: A1.13 75.59,67.5 78,67.5 78.48,67.98 JP7.2
T6
  Bottom 0.61: JP6.2 78.47,73.47 77.83,72.83 75.33,72.83 A1.15
TX  (via drill 1)
  Top 0.127: v96.14,50.5 v99.94,50.5
  Bottom 0.406: 89.66,50.54 92.07,50.54
  Bottom 0.813: U$1.PC6 88.39,49.27 89.66,50.54 | 92.07,50.54 96.28,50.54 96.3,50.52 96.16,50.52 v96.14,50.5 | v99.94,50.5 115.64,50.5 116.4,51.26 116.4,52.6 V1.17
TX1
  Bottom 0.406: 102.2,39.81 102.2,37.7 102.16,37.66
  Bottom 0.813: U$1.PA9 103.44,41.05 102.2,39.81 | 102.16,37.66 102.16,37.41 101.23,36.48 97.35,36.48 96.82,35.95 96.82,33.06 KOMPAS.4
TX2
  Bottom 0.61: D7.C R1.2 66.5,77 70,81 72.5,81 77,76.5 84,76.5 85.5,75 85.5,69.75 U$1.PB11
UV
  Bottom 0.813: U$1.PE0 131.38,37.86 133.03,36.21 135.15,36.21 R7.1 137.08,35.76 138.21,34.63 138.21,32.09 D2.C
VCC  (via drill 1)  (1 unrouted)
  Top 0.127: v67.09,37.4 67.09,33.08 | v126.63,64.01 v126.63,60.21
  Top 0.406: v84.32,83.59 v100.09,83.59
  Top 0.813: 67.09,33.08 v67.07,33.06 | 84.17,83.74 v84.32,83.59 | v81,46 v81,39.5 | v76,81.74 76.02,81.72 v84.35,81.72 | v64,71.5 v64,64.5
  Bottom 0.406: LCD.3 85.16,88.24 84.02,87.1 84.02,83.89 v84.32,83.59
  Bottom 0.813: IC2.3 C4.+ 125.9,66.16 126.68,65.38 126.68,63.96 | JP12.2 124.81,86.79 JP20.2 121.85,86.58 119.86,86.58 119.63,86.81 JP23.2 116.44,86.77 JP18.2 113.61,86.79 JP17.2 110.76,86.74 JP13.2 JP11.2 105.08,86.77 JP14.2 102.2,86.71 100.99,86.71 100.09,85.81 v100.09,83.59 | U$1.VCC 140.09,41.21 | 140.09,41.21 140.91,40.39 140.91,40.38 | 140.91,40.38 140.91,27.57 139.73,26.39 133.3,26.39 132.33,27.36 UV.2 131.47,27.34 TPA2.2 127.54,27.41 TPA.2 | D3.C 98.36,41.97 U$1.VCC@1 97.94,40.79 90.28,40.79 89.08,39.59 83.59,39.59 82,38 81.5,38 | KOMPAS.2 96.33,27.49 72.2,27.49 71.61,28.08 SG1.+ 71.17,30.4 68,30.4 | 141.74,41.21 140.09,41.21 | 141.74,41.21 147.78,41.21 SOUND.2 150.24,42.6 151.07,43.43 151.07,46.79 150.45,47.41 145.6,47.41 144.86,48.15 144.86,53.74 144.09,54.51 140.92,54.51 140.26,53.85 140.26,49.45 139.67,48.86 120.41,48.86 | 140.91,40.38 141.74,41.21 | 120.41,48.86 119.63,48.08 119.63,47.04 | 119.63,47.04 119.63,45.71 118.88,45.14 118.82,45.2 103.8,45.2 103.35,44.75 103.33,44.75 102.07,43.49 D3.C | 99.84,43.53 D3.C | 126.68,63.9 126.68,63.96 | 126.68,63.96 v126.63,64.01 | v126.63,60.21 126.63,55.83 124.46,53.66 124.46,52.52 124.43,52.49 V1.20 124.17,51.94 123.07,50.84 120.2,50.84 119.64,50.28 119.64,49.39 | 119.64,49.39 119.64,47.05 119.63,47.04 | 120.41,48.86 120.17,48.86 119.64,49.39 | v84.32,83.59 84.32,81.75 v84.35,81.72 | 66,30.4 68,30.4 | 66,30.4 X1.2 | v67.07,33.06 67.07,31.33 | 67.07,31.33 68,30.4 | 67.07,31.33 66.93,31.33 66,30.4 | JP3.3 v81,46 | 80.5,38 78.5,38 77.5,39 72.6,39 71,37.4 v67.09,37.4 66.99,37.5 65,37.5 61.49,41.01 61.49,43.49 60.74,44.24
  Bottom 0.813: 81.5,38 80.5,38 | v81,39.5 81,38.5 | 81,38.5 80.5,38 | 81,38.5 81.5,38 | v76,81.74 74.39,83.35 R3.E 70.35,83.35 64,77 v64,71.5 | 59.74,45.24 60.24,44.74 | 59.74,45.24 A1.27 | 60.74,44.24 60.24,44.74 | v64,64.5 64,48.5 60.75,45.25 | 60.75,45.25 60.24,44.74 | 60.75,45.25 59.75,45.25 59.74,45.24 | 60.75,45.25 60.75,44.25 60.74,44.24
  Bottom 1.016: JP6.3 81.01,69.35 JP7.3 81.02,64.08 JP4.3 81.01,58.73 JP5.3 80.99,53.75 JP2.3 81.01,48.61 JP3.3
(copper drawn outside any net)
  shapes: Top area x2

### Text on the board
Dimension: Garis
tPlace: IR | SRF